# EAGLE schematic untitled (EAGLE 9.5.2)
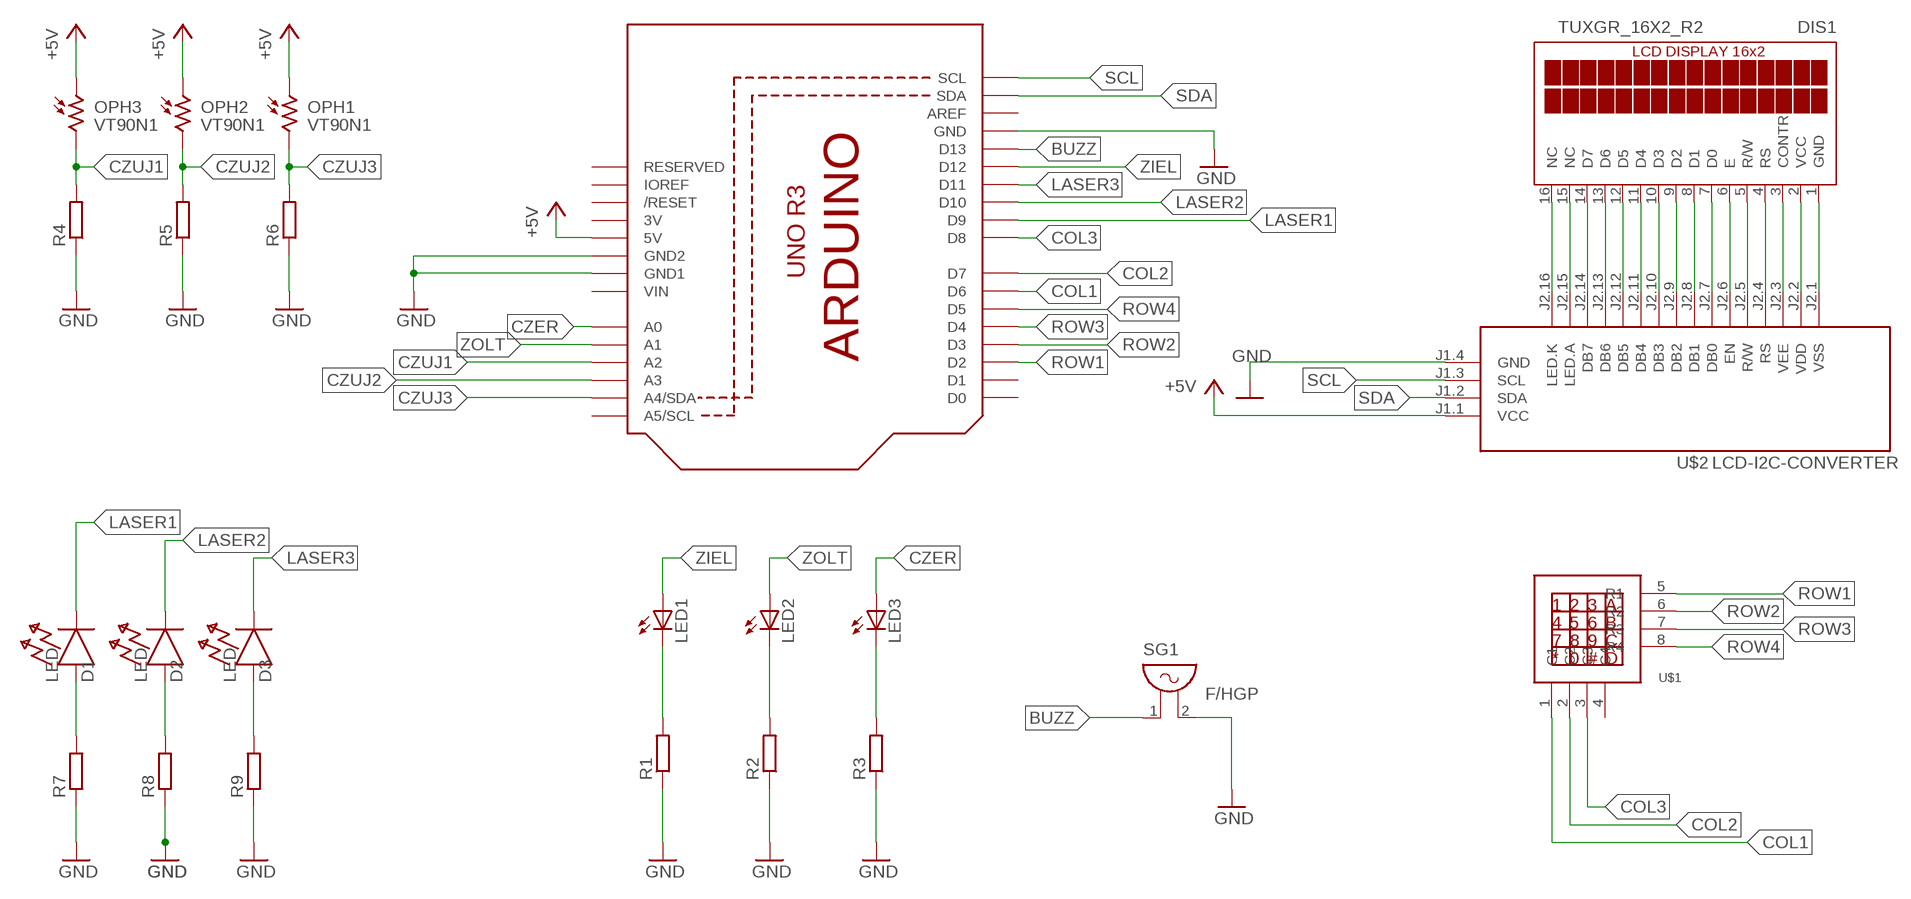
[diagram p0: schematic, sheet 1]

## Parts
D1  LED  (no package)
D2  LED  (no package)
D3  LED  (no package)
DIS1  TUXGR_16X2_R2  [TUXGR_16X2_R2]
LED1  LED5MM  [LED5MM]
LED2  LED5MM  [LED5MM]
LED3  LED5MM  [LED5MM]
OPH1  VT90N1  [VT900]
OPH2  VT90N1  [VT900]
OPH3  VT90N1  [VT900]
R1  R-EU_0207/7  [0207/7]
R2  R-EU_0207/7  [0207/7]
R3  R-EU_0207/7  [0207/7]
R4  R-EU_0207/7  [0207/7]
R5  R-EU_0207/7  [0207/7]
R6  R-EU_0207/7  [0207/7]
R7  R-EU_0207/7  [0207/7]
R8  R-EU_0207/7  [0207/7]
R9  R-EU_0207/7  [0207/7]
SG1  F/HGP  [F/HGP]
U1  ARDUINOR3-BPLACE  [ARDUINOR3-BPLACE]
U$1  KEYPAD4X4  [KEYPAD4X4]
U$2  LCD-I2C-CONVERTER  [LCD-I2C-CONVERTER]

## Nets
+5V: OPH1.1 OPH2.1 OPH3.1 U1.5V U$2.J1.1(VCC)
BUZZ: SG1.1 U1.D13
COL1: U1.D6 U$1.1(C1)
COL2: U1.D7 U$1.2(C2)
COL3: U1.D8 U$1.3(C3)
CZER: LED3.A U1.A0
CZUJ1: OPH3.2 R4.2 U1.A2
CZUJ2: OPH2.2 R5.2 U1.A3
CZUJ3: OPH1.2 R6.2 U1.A4(A4/SDA)
GND: R1.1 R2.1 R3.1 R4.1 R5.1 R6.1 R7.1 R8.1 R9.1 SG1.2 U1.GND U1.GND1 U1.GND2 U$2.J1.4(GND)
LASER1: D1.C U1.D9
LASER2: D2.C U1.D10
LASER3: D3.C U1.D11
N$1: DIS1.1(GND) DIS1.16(NC) U$2.J2.1(VSS) U$2.J2.16(LED.K)
N$2: DIS1.2(VCC) DIS1.15(NC) U$2.J2.2(VDD) U$2.J2.15(LED.A)
N$3: DIS1.3(CONTR) DIS1.14(D7) U$2.J2.3(VEE) U$2.J2.14(DB7)
N$4: DIS1.4(RS) DIS1.13(D6) U$2.J2.4(RS) U$2.J2.13(DB6)
N$5: DIS1.5(R/W) DIS1.12(D5) U$2.J2.5(R/W) U$2.J2.12(DB5)
N$6: DIS1.6(E) DIS1.11(D4) U$2.J2.6(EN) U$2.J2.11(DB4)
N$7: DIS1.7(D0) DIS1.10(D3) U$2.J2.7(DB0) U$2.J2.10(DB3)
N$9: DIS1.8(D1) DIS1.9(D2) U$2.J2.8(DB1) U$2.J2.9(DB2)
N$12: LED3.K(C) R3.2
N$13: LED2.K(C) R2.2
N$14: LED1.K(C) R1.2
N$18: D3.A R9.2
N$19: D2.A R8.2
N$20: D1.A R7.2
ROW1: U1.D2 U$1.5(R1)
ROW2: U1.D3 U$1.6(R2)
ROW3: U1.D4 U$1.7(R3)
ROW4: U1.D5 U$1.8(R4)
SCL: U1.SCL U$2.J1.3(SCL)
SDA: U1.SDA U$2.J1.2(SDA)
ZIEL: LED1.A U1.D12
ZOLT: LED2.A U1.A1
Unconnected: U1.A5(A5/SCL) U1.AREF U1.D0 U1.D1 U1.IOREF U1.RESERVED U1.RESET(/RESET) U$1.4(C4)

## Power pins joined to a net without a drawn wire
3V: U1.3V
VIN: U1.VIN

## Library data of the parts
D1-D3 = ngspice-simulation:LED: Diode
DIS1 = display-lcd:TUXGR_16X2_R2: Tuxgraphics LCD display 16x2 characters reflective, without background light Source: tuxgr_12x2_r2.pdf; OC_FARNELL: unknown; OC_NEWARK: unknown
LED1-LED3 = adafruit:LED: LED OSRAM: - CHIPLED LG R971, LG N971, LY N971, LG Q971, LY Q971, LO R971, LY R971 LH N974, LH R974 LS Q976, LO Q976, LY Q976 LO Q996 - Hyper CHIPLED LW Q18S LB Q993, LB Q99A, LB R99A - SideLED LS A670, LO A670, LY A670, LG A670, LP A670 LB A673, LV A673, LT A673, LW A673 LH A674 LY A675 LS A676, LA A676, LO A676, LY A676, LW A676 LS A679, LY A679, LG A679 - Hyper Micro SIDELED® LS Y876, LA Y876, LO Y876, LY Y876 LT Y87S - SmartLED LW L88C, LW L88S LB L89C, LB L89S, LG L890 LS L89K, LO L89K, LY L89K LS L896, LA L896, LO L896, LY L896 - TOPLED LS T670, LO T670, LY T670, LG T670, LP T670 LSG T670, LSP T670, LSY T670, LOP T670, LYG T670 LG T671, LOG T671, LSG T671 LB T673, LV T673, LT T673, LW T673 LH T674 LS T676, LA T676, LO T676, LY T676, LB T676, LH T676, LSB T676, LW T676 LB T67C, LV T67C, LT T67C, LS T67K, LO T67K, LY T67K, LW E67C LS E67B, LA E67B, LO E67B, LY E67B, LB E67C, LV E67C, LT E67C LW T67C LS T679, LY T679, LG T679 LS T770, LO T770, LY T770, LG T770, LP T770 LB T773, LV T773, LT T773, LW T773 LH T774 LS E675, LA E675, LY E675, LS T675 LS T776, LA T776, LO T776, LY T776, LB T776 LHGB T686 LT T68C, LB T68C - Hyper Mini TOPLED® LB M676 - Mini TOPLED Santana® LG M470 LS M47K, LO M47K, LY M47K Source: http://www.osram.convergy.de/
OPH1-OPH3 = photo-elements:VT9: Photoconductive Cell VT900 Series Source: http://optoelectronics.perkinelmer.com/content/Datasheets/DTS_vt900seriesdatasheet.pdf
R1-R9 = rcl:R-EU_: RESISTOR, European symbol; SPICEPREFIX: R
SG1 = buzzer:F/HGP: BUZZER Source: Buerklin; OC_FARNELL: unknown; OC_NEWARK: unknown
U1 = adafruit:ARDUINOR3: This is a new object for the new Arduino R3 - with extra pins that you may want to use (such as IOref, and duplicated A4/A5
U$1 = klawiaturamembranowa4x4:KEYPAD4X4
U$2 = diy-modules:LCD-I2C-CONVERTER: I2C Bus to 4-Bit Parallel LCD Interface with LED backlight driver